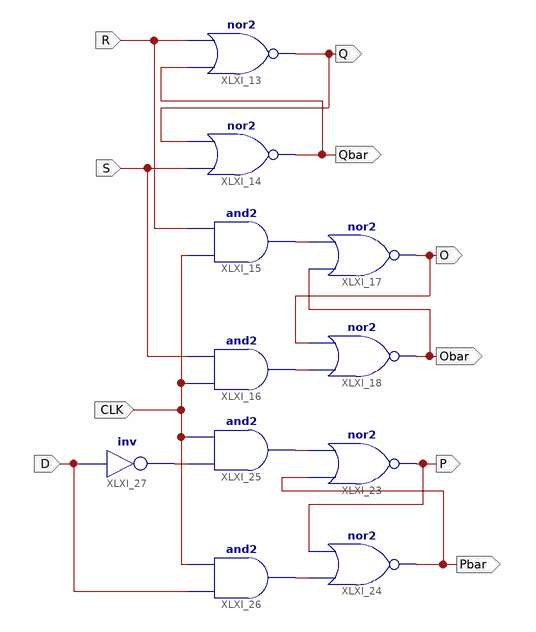
[diagram p0: schematic sheet 1]
// Xilinx ISE schematic sch.sch (spartan3e) as structural Verilog: 11 symbols, 10 ports
module sch (
  input  CLK,
  input  R,
  input  S,
  input  D,
  output Q,
  output Qbar,
  output Pbar,
  output P,
  output O,
  output Obar
);

  wire XLXN_22, XLXN_23, XLXN_33, XLXN_34, XLXN_41;

  nor XLXI_13 (Q, Qbar, R);
  nor XLXI_14 (Qbar, S, Q);
  nor XLXI_17 (O, Obar, XLXN_22);
  nor XLXI_18 (Obar, XLXN_23, O);
  and XLXI_15 (XLXN_22, CLK, R);
  and XLXI_16 (XLXN_23, CLK, S);
  nor XLXI_23 (P, Pbar, XLXN_33);
  nor XLXI_24 (Pbar, XLXN_34, P);
  and XLXI_25 (XLXN_33, XLXN_41, CLK);
  and XLXI_26 (XLXN_34, D, CLK);
  not XLXI_27 (XLXN_41, D);
endmodule
